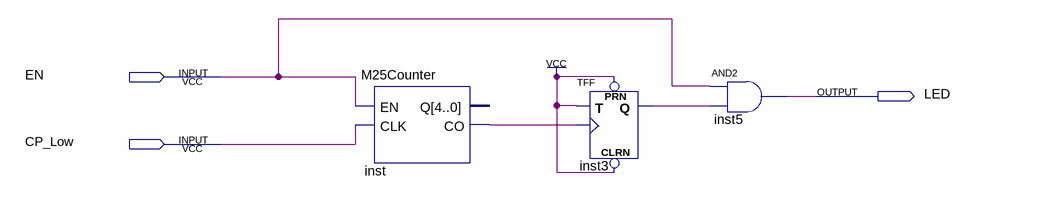
[diagram p0: schematic sheet]
// Quartus schematic Blinker.bdf as structural Verilog: 3 symbols, 3 pins
module Blinker (
  input  EN,
  input  CP_Low,
  output LED
);

  wire inst3_q, inst_co;

  M25Counter inst (.EN(EN), .CLK(CP_Low), .CO(inst_co));  // open: Q
  TFF inst3 (.PRN(1'b1), .CLRN(1'b1), .T(1'b1), .CLK(inst_co), .Q(inst3_q));
  and inst5 (LED, EN, inst3_q);
endmodule
